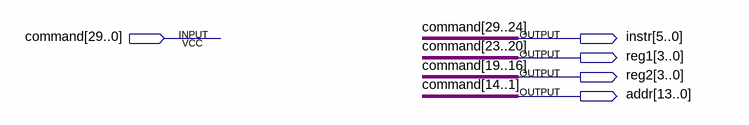
[diagram p0: schematic sheet]
// Quartus schematic InstrDecode.bdf as structural Verilog: 0 symbols, 5 pins
module InstrDecode (
  input  [29:0] command,
  output [5:0] instr,
  output [3:0] reg1,
  output [3:0] reg2,
  output [13:0] addr
);


  assign addr = command[14:1];
  assign instr = command[29:24];
  assign reg1 = command[23:20];
  assign reg2 = command[19:16];
endmodule
